# EAGLE design sensor 1 (EAGLE 6.6.0)
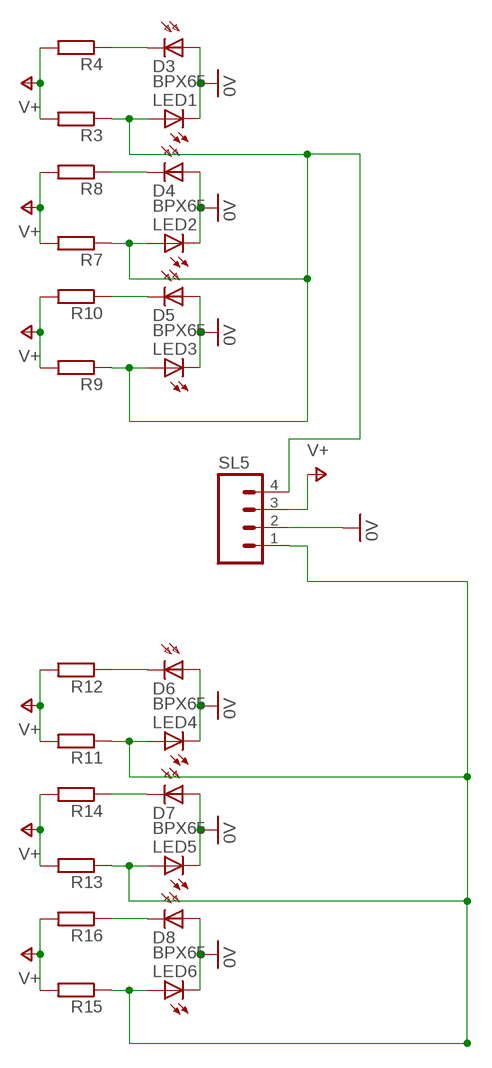
[diagram p0: schematic, sheet 1]

## Parts
D3  BPX65  [BPX65]
D4  BPX65  [BPX65]
D5  BPX65  [BPX65]
D6  BPX65  [BPX65]
D7  BPX65  [BPX65]
D8  BPX65  [BPX65]
LED1  LED5MM  [LED5MM]
LED2  LED5MM  [LED5MM]
LED3  LED5MM  [LED5MM]
LED4  LED5MM  [LED5MM]
LED5  LED5MM  [LED5MM]
LED6  LED5MM  [LED5MM]
R3  R-EU_0204/7  [0204/7]
R4  R-EU_0204/7  [0204/7]
R7  R-EU_0204/7  [0204/7]
R8  R-EU_0204/7  [0204/7]
R9  R-EU_0204/7  [0204/7]
R10  R-EU_0204/7  [0204/7]
R11  R-EU_0204/7  [0204/7]
R12  R-EU_0204/7  [0204/7]
R13  R-EU_0204/7  [0204/7]
R14  R-EU_0204/7  [0204/7]
R15  R-EU_0204/7  [0204/7]
R16  R-EU_0204/7  [0204/7]
SL5  M04  [04P]

## Nets
0V: D3.A D4.A D5.A D6.A D7.A D8.A LED1.K(C) LED2.K(C) LED3.K(C) LED4.K(C) LED5.K(C) LED6.K(C) SL5.2
N$1: LED4.A LED5.A LED6.A R11.1 R13.1 R15.1 SL5.1
N$18: D3.K(C) R4.1
N$19: LED1.A LED2.A LED3.A R3.1 R7.1 R9.1 SL5.4
N$22: D4.K(C) R8.1
N$26: D5.K(C) R10.1
N$30: D6.K(C) R12.1
N$34: D7.K(C) R14.1
N$38: D8.K(C) R16.1
V+: R3.2 R4.2 R7.2 R8.2 R9.2 R10.2 R11.2 R12.2 R13.2 R14.2 R15.2 R16.2 SL5.3

## Library data of the parts
D3-D8 = opto-trans-siemens:BPX65: PHOTO DIODE; MPN: BPX65.; OC_FARNELL: 327451; OC_NEWARK: 06WX2764
LED1-LED6 = led:LED: LED OSRAM: - CHIPLED LG R971, LG N971, LY N971, LG Q971, LY Q971, LO R971, LY R971 LH N974, LH R974 LS Q976, LO Q976, LY Q976 LO Q996 - Hyper CHIPLED LW Q18S LB Q993, LB Q99A, LB R99A - SideLED LS A670, LO A670, LY A670, LG A670, LP A670 LB A673, LV A673, LT A673, LW A673 LH A674 LY A675 LS A676, LA A676, LO A676, LY A676, LW A676 LS A679, LY A679, LG A679 - Hyper Micro SIDELED® LS Y876, LA Y876, LO Y876, LY Y876 LT Y87S - SmartLED LW L88C, LW L88S LB L89C, LB L89S, LG L890 LS L89K, LO L89K, LY L89K LS L896, LA L896, LO L896, LY L896 - TOPLED LS T670, LO T670, LY T670, LG T670, LP T670 LSG T670, LSP T670, LSY T670, LOP T670, LYG T670 LG T671, LOG T671, LSG T671 LB T673, LV T673, LT T673, LW T673 LH T674 LS T676, LA T676, LO T676, LY T676, LB T676, LH T676, LSB T676, LW T676 LB T67C, LV T67C, LT T67C, LS T67K, LO T67K, LY T67K, LW E67C LS E67B, LA E67B, LO E67B, LY E67B, LB E67C, LV E67C, LT E67C LW T67C LS T679, LY T679, LG T679 LS T770, LO T770, LY T770, LG T770, LP T770 LB T773, LV T773, LT T773, LW T773 LH T774 LS E675, LA E675, LY E675, LS T675 LS T776, LA T776, LO T776, LY T776, LB T776 LHGB T686 LT T68C, LB T68C - Hyper Mini TOPLED® LB M676 - Mini TOPLED Santana® LG M470 LS M47K, LO M47K, LY M47K Source: http://www.osram.convergy.de LUXEON: - LUMILED® LXK2-PW12-R00, LXK2-PW12-S00, LXK2-PW14-U00, LXK2-PW14-V00 LXK2-PM12-R00, LXK2-PM12-S00, LXK2-PM14-U00 LXK2-PE12-Q00, LXK2-PE12-R00, LXK2-PE12-S00, LXK2-PE14-T00, LXK2-PE14-U00 LXK2-PB12-K00, LXK2-PB12-L00, LXK2-PB12-M00, LXK2-PB14-N00, LXK2-PB14-P00, LXK2-PB14-Q00 LXK2-PR12-L00, LXK2-PR12-M00, LXK2-PR14-Q00, LXK2-PR14-R00 LXK2-PD12-Q00, LXK2-PD12-R00, LXK2-PD12-S00 LXK2-PH12-R00, LXK2-PH12-S00 LXK2-PL12-P00, LXK2-PL12-Q00, LXK2-PL12-R00 Source: www.luxeon.com KINGBRIGHT: KA-3528ASYC Source: www.kingbright.com
R3 R4 R7-R16 = resistor:R-EU_: RESISTOR, European symbol
SL5 = con-amp-quick:M04: AMP QUICK CONNECTOR; OC_FARNELL: unknown; OC_NEWARK: unknown

## Board
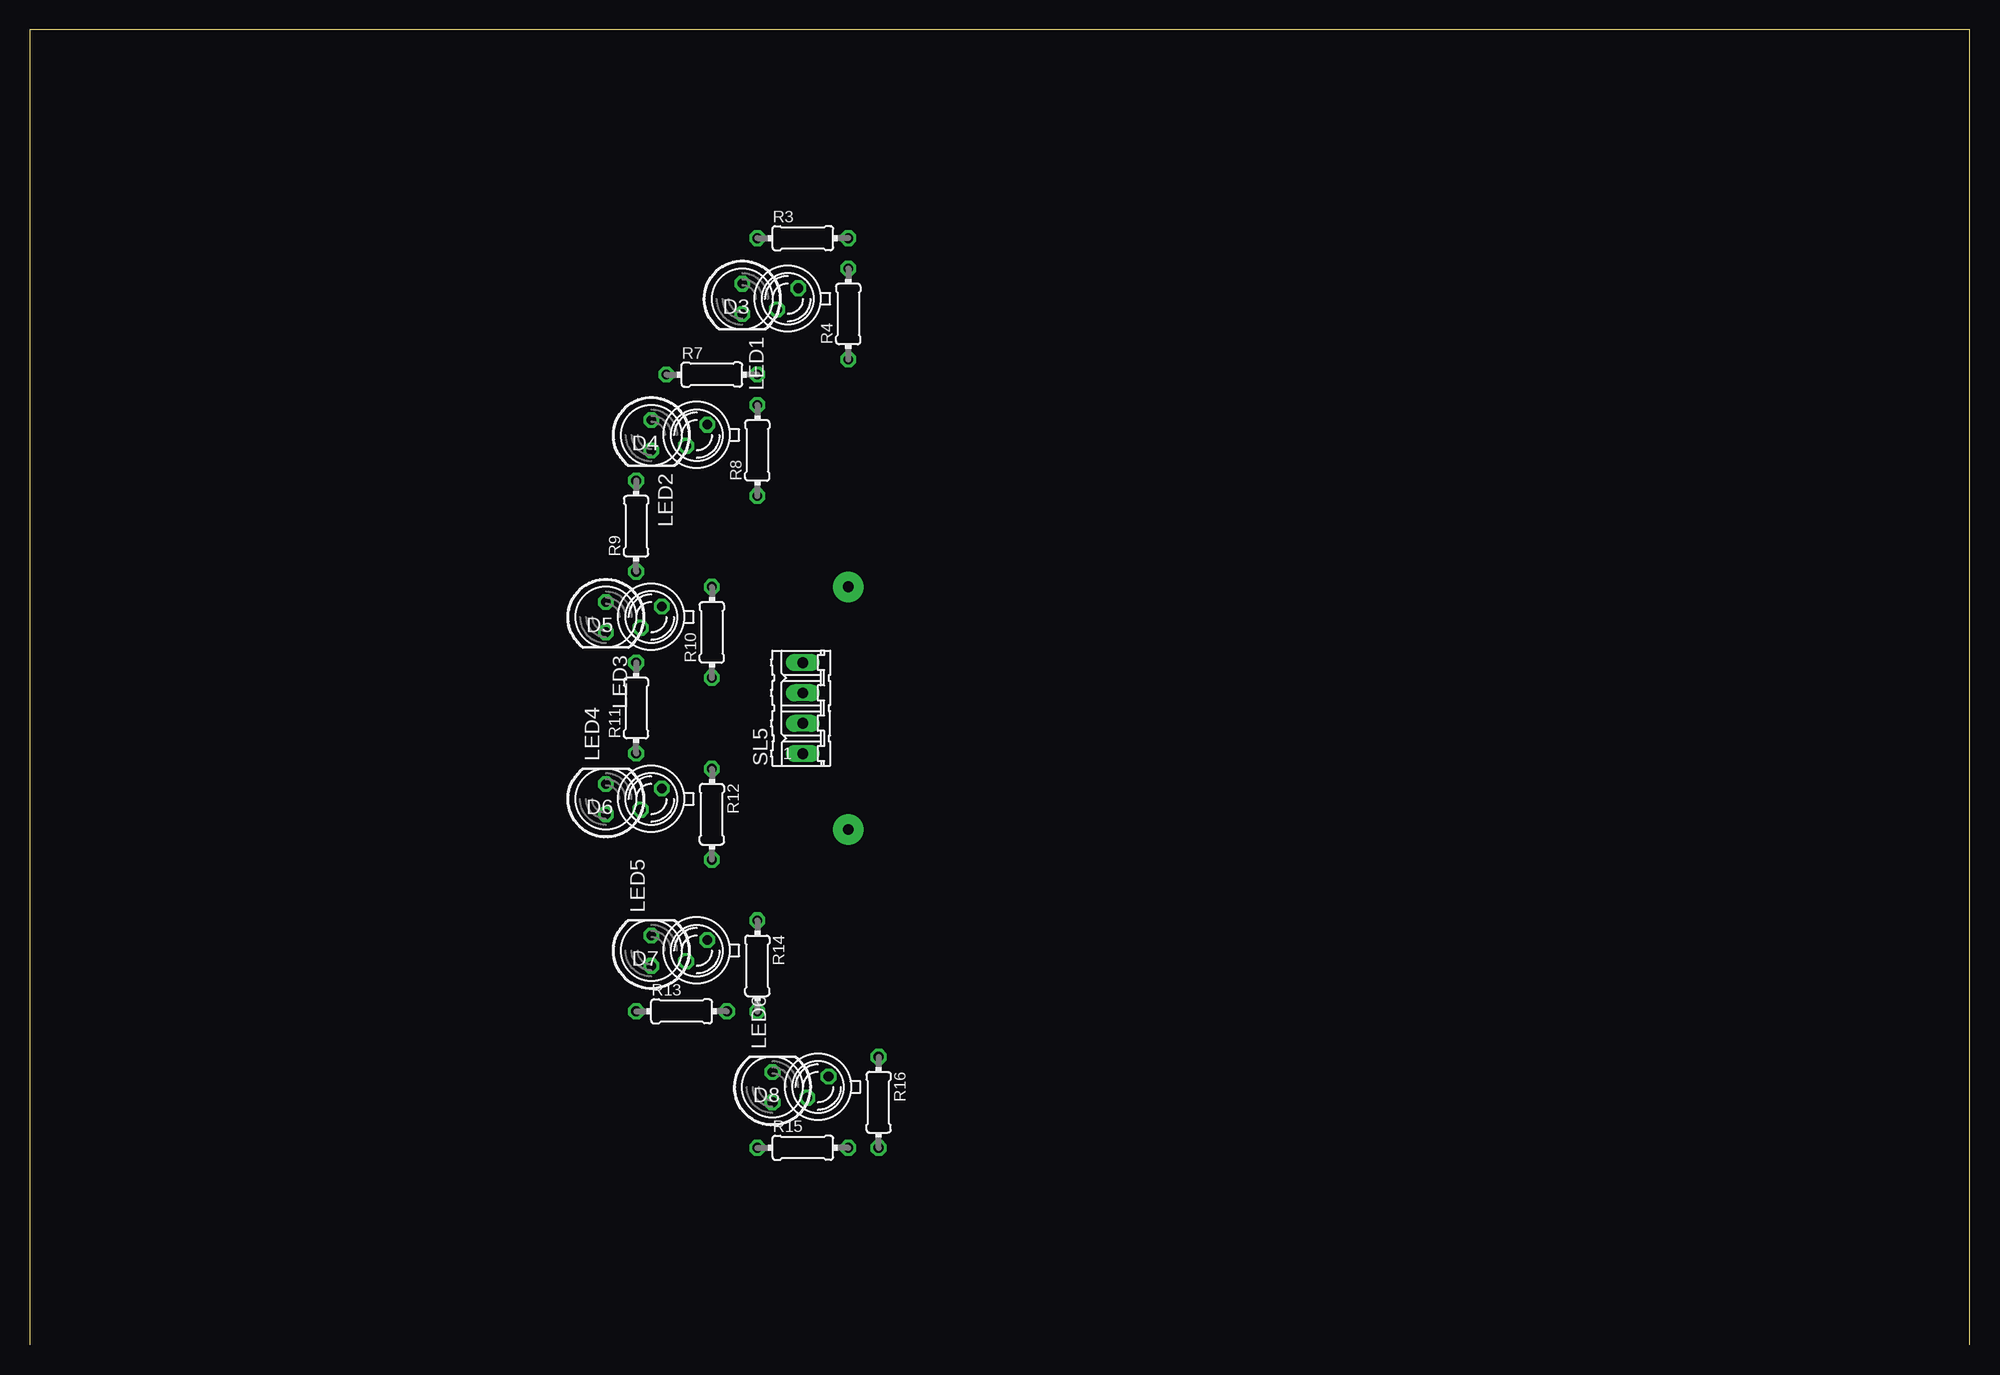
[diagram p1: board, top side]
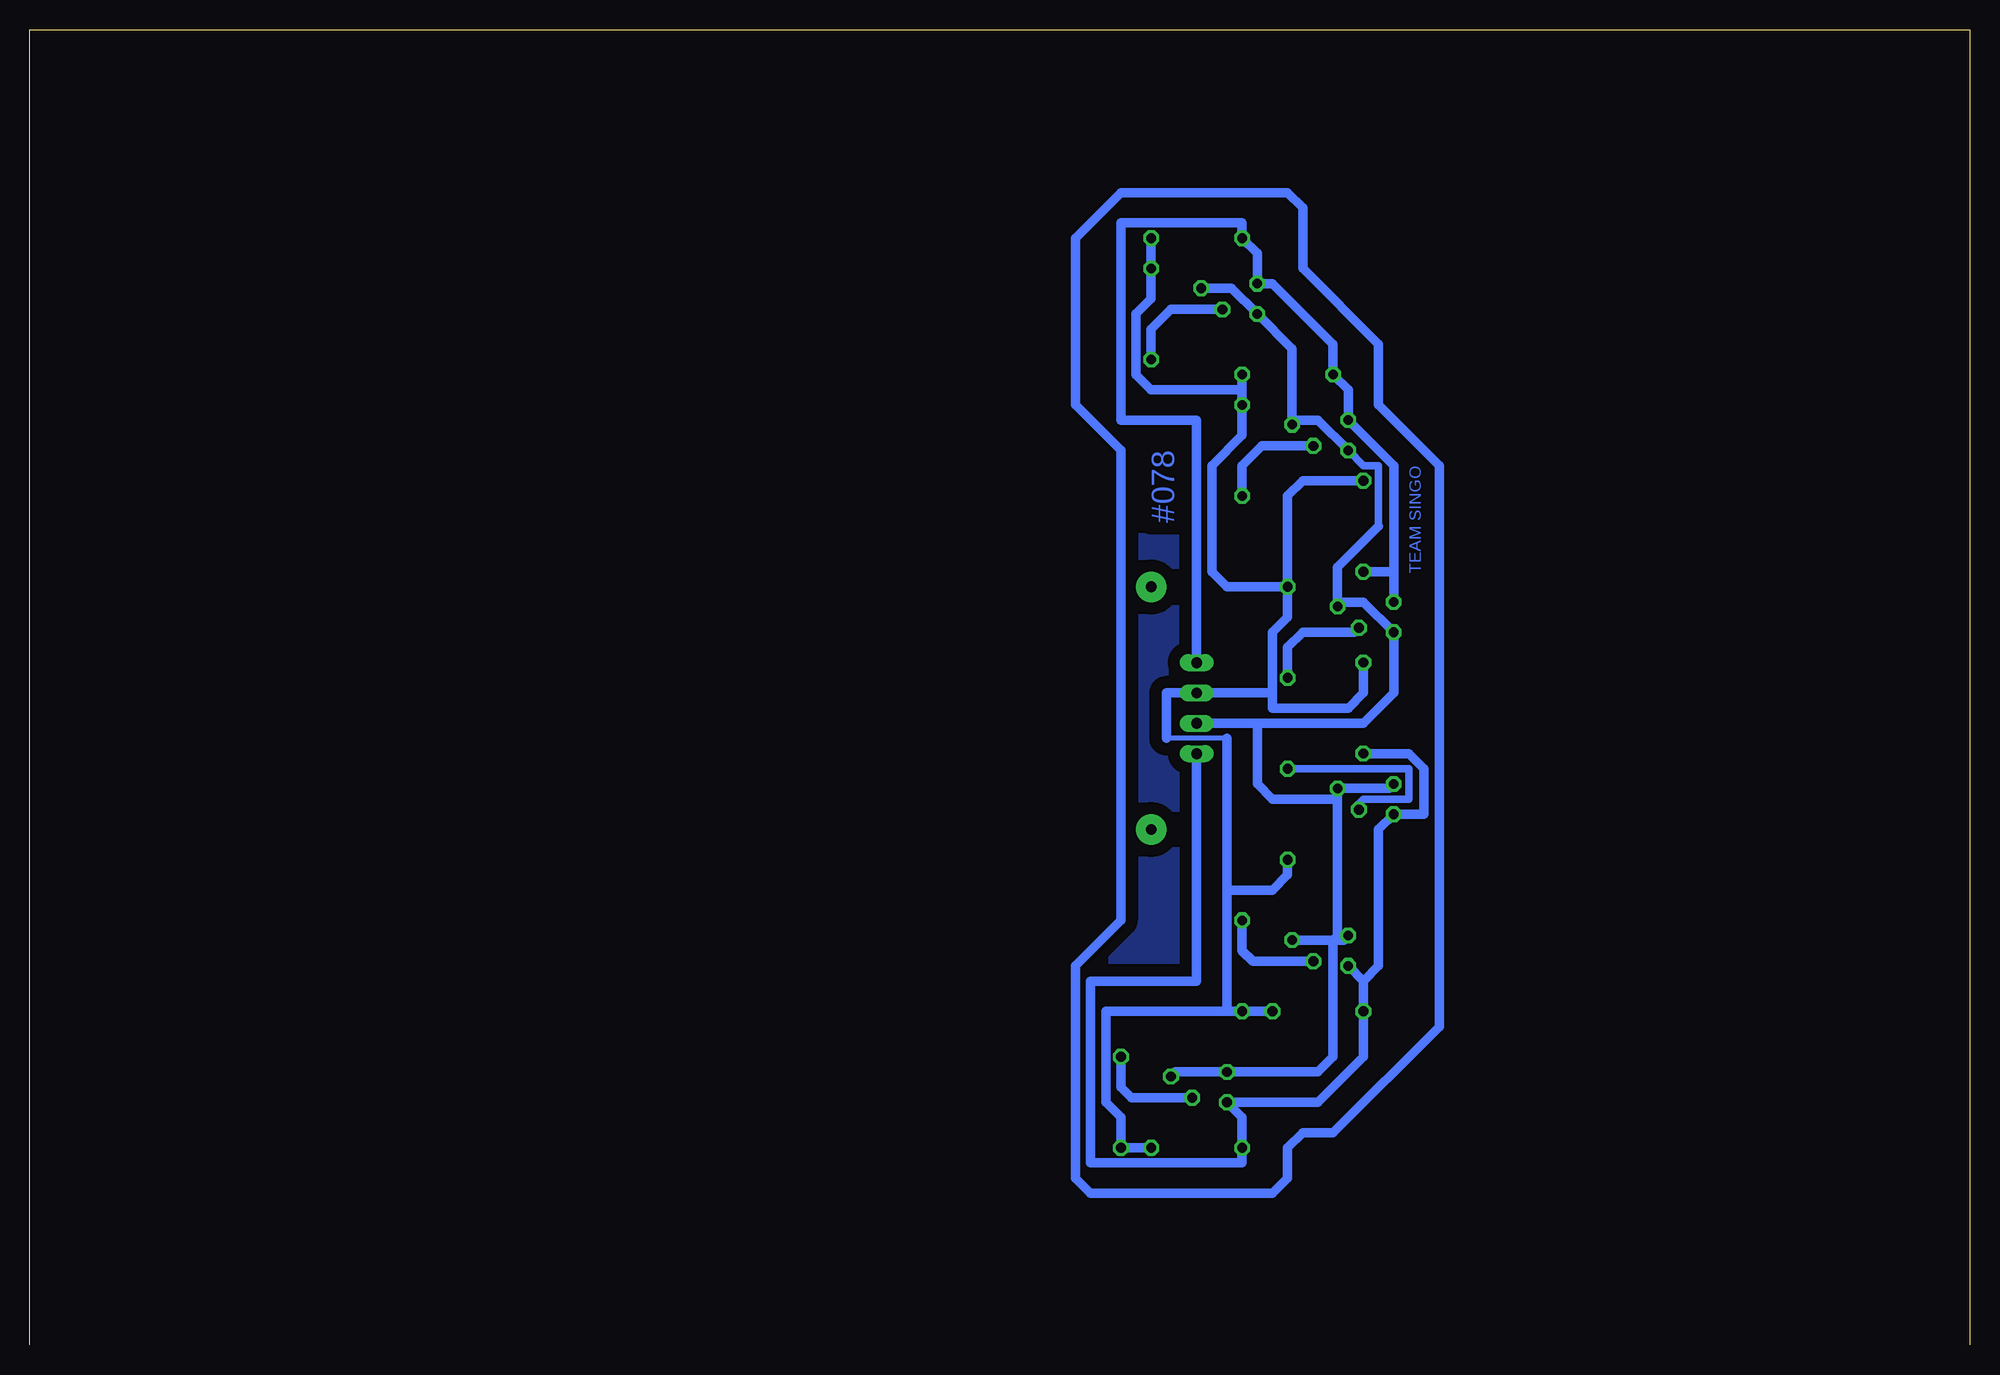
[diagram p2: board, bottom side, seen from below]

Size 162.54 x 110.16 mm. Coordinates in mm from the lower left corner, seen from the top.
Outline: 162.54,0 162.54,110.16 0,110.16 0,0
Copper layers (1*16): Top 0.035mm / dielectric 1.5mm / Bottom 0.035mm
Design rules "default": minimum track width 10mil, minimum drill 24mil, track to track 8mil, track to pad 8mil, pad to pad 8mil, via to via 8mil, smd to smd 8mil, copper to edge 40mil, drill to drill 8mil, minimum pad ring 10mil, minimum via ring 8mil, stop-mask expansion 4mil, vias tented up to drill 0mil, thermal gap 10mil

### Footprints (pad centres in the part's own frame; a part is rotated, then mirrored left to right if it is on the bottom)
BPX65 = drill 0.813 octagon: A -0.889,-0.889; K 0.889,0.889
LED5MM = drill 0.813 octagon: A -1.27,0; K 1.27,0
0204/7 = drill 0.813 octagon: 1 -3.81,0; 2 3.81,0
04P = drill 0.914 long: 1 -3.81,0; 2 -1.27,0; 3 1.27,0; 4 3.81,0

### Placement (x,y rotation side)
D3  63.5,87.63 180 top
D4  55.88,76.2 180 top
D5  52.07,60.96 180 top
D6  52.07,45.72 180 top
D7  55.88,33.02 180 top
D8  66.04,21.59 180 top
LED1  59.69,87.63 270 top
LED2  52.07,76.2 270 top
LED3  48.26,60.96 270 top
LED4  48.26,45.72 90 top
LED5  52.07,33.02 90 top
LED6  62.23,21.59 90 top
R3  64.77,92.71 0 top
R4  68.58,86.36 90 top
R7  57.15,81.28 0 top
R8  60.96,74.93 90 top
R9  50.8,68.58 90 top
R10  57.15,59.69 90 top
R11  50.8,53.34 90 top
R12  57.15,44.45 270 top
R13  54.61,27.94 0 top
R14  60.96,31.75 270 top
R15  64.77,16.51 0 top
R16  71.12,20.32 270 top
SL5  64.77,53.34 90 top

### Tracks (layer width: path | path; a pad name or v marks a point on that pad's centre or on a via)
0V
  Bottom 0.61: 49.53,68.58 49.53,73.66 50.8,73.66 LED2.K
  Bottom 0.813: D8.A 66.55,22.86 LED6.K 54.61,22.86 53.34,24.13 53.34,33.91 | D7.A 53.34,33.91 | 53.34,33.91 52.45,33.91 LED5.K | 52.96,45.72 D6.A 48.64,46.61 LED4.K | 52.96,45.72 52.96,34.29 53.34,33.91 | 59.69,52.07 59.69,46.99 58.42,45.72 52.96,45.72 | 59.69,52.07 50.8,52.07 48.26,54.61 LED3.K 50.8,62.23 52.58,62.23 D5.A 52.96,65.15 49.53,68.58 | D3.A 61.85,88.52 LED1.K 56.77,83.44 D4.A 56.39,77.47 54.61,77.47 LED2.K | 59.69,52.07 SL5.2
N$1
  Bottom 0.813: 50.8,30.48 R13.1 50.8,24.13 54.61,20.32 LED6.A 60.96,19.05 R15.1 60.96,15.24 73.66,15.24 73.66,30.48 64.77,30.48 SL5.1 | LED5.A 50.8,30.48 | 50.8,30.48 49.53,31.75 49.53,43.18 LED4.A 45.72,44.45 45.72,48.26 46.99,49.53 R11.1
N$2
  Bottom 0.813: 44.45,26.67 44.45,73.66 49.53,78.74 49.53,83.82 55.88,90.17 55.88,95.25 57.15,96.52 71.12,96.52 74.93,92.71 74.93,78.74 71.12,74.93 71.12,35.56 74.93,31.75 74.93,13.97 73.66,12.7 58.42,12.7 57.15,13.97 57.15,16.51 55.88,17.78 53.34,17.78 44.45,26.67
N$3  (via drill 0.9 pad 2.54)
  other vias: 68.58,63.5
N$4  (via drill 0.9 pad 2.54)
  other vias: 68.58,43.18
N$5
  pour Bottom (isolate 1.016): 71.12,35.56 74.93,31.75 74.93,30.48 66.04,30.48 64.77,31.75 64.77,76.2 66.04,77.47 73.66,77.47 71.12,74.93
N$18
  Bottom 0.813: D3.K 66.93,86.74 68.58,85.09 R4.1
N$19
  Bottom 0.813: LED3.A 48.26,64.77 | R9.1 48.26,64.77 | 48.26,64.77 48.26,73.66 LED2.A 52.07,80.01 R7.1 53.34,83.82 58.42,88.9 LED1.A 59.69,91.44 R3.1 60.96,93.98 71.12,93.98 71.12,77.47 64.77,77.47 SL5.4
N$22
  Bottom 0.813: D4.K 59.31,75.31 60.96,73.66 R8.1
N$26
  Bottom 0.813: R10.1 57.15,58.42 55.88,59.69 51.56,59.69 D5.K
N$30
  Bottom 0.61: D6.K 51.18,45.34 50.8,45.72 46.99,45.72 46.99,48.26 R12.1
N$34
  Bottom 0.813: D7.K 60.07,32.13 60.96,33.02 R14.1
N$38
  Bottom 0.813: D8.K 70.23,20.7 71.12,21.59 R16.1
V+
  Bottom 0.406: 62.23,50.8 67.31,50.8
  Bottom 0.813: R13.2 R14.2 62.23,27.94 | R3.2 R4.2 68.58,87.63 69.85,86.36 69.85,81.28 68.58,80.01 60.96,80.01 | R7.2 60.96,80.01 | 60.96,80.01 R8.2 60.96,76.2 63.5,73.66 63.5,64.77 62.23,63.5 R10.2 | R15.2 R16.2 71.12,19.05 72.39,20.32 72.39,27.94 62.23,27.94 | R12.2 57.15,39.37 58.42,38.1 62.23,38.1 | 62.23,38.1 62.23,27.94 | R11.2 50.8,54.61 52.07,53.34 58.42,53.34 58.42,54.61 | R10.2 57.15,71.12 55.88,72.39 R9.2 | R10.2 57.15,60.96 58.42,59.69 58.42,54.61 | 58.42,54.61 SL5.3 67.31,54.61 67.31,50.8 | 62.23,38.1 62.23,50.8

### Text on the board
Bottom: #078 | TEAM SINGO